# Altium schematic sheet electro1.SchDoc
size A4
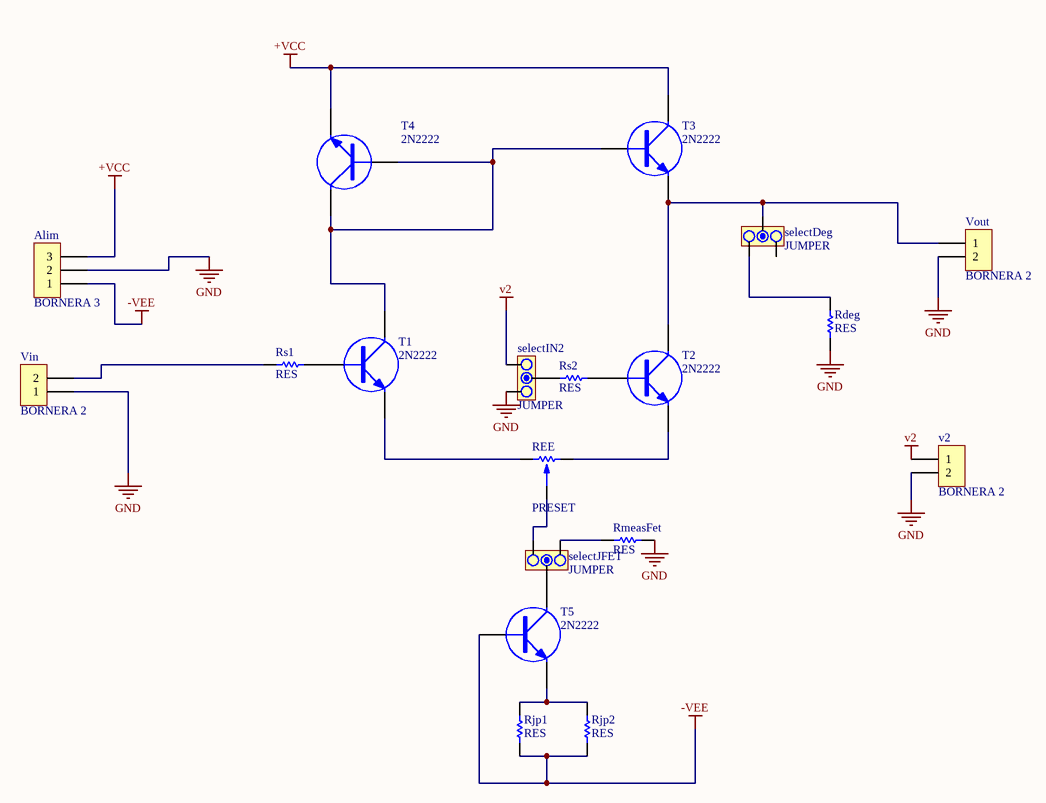
[diagram p0: electro1.SchDoc]

## Parts
Alim  BORNERA 3  [BORNERA3]
Rdeg  RES  [RES300]
REE  PRESET  [PRESET V]
Rjp1  RES  [RES300]
Rjp2  RES  [RES300]
RmeasFet  RES  [RES300]
Rs1  RES  [RES300]
Rs2  RES  [RES300]
selectDeg  JUMPER  [JUMPER3]
selectIN2  JUMPER  [JUMPER3]
selectJFET  JUMPER  [JUMPER3]
T1  2N2222  [TO92]
T2  2N2222  [TO92]
T3  2N2222  [TO92]
T4  2N2222  [TO92]
T5  2N2222  [TO92]
v2  BORNERA 2  [BORNERA2]
Vin  BORNERA 2  [BORNERA2]
Vout  BORNERA 2  [BORNERA2]

## Nets
+VCC: Alim.3 T3.3(C) T4.2(E)
-VEE: Alim.1 Rjp1.1 Rjp2.1 T5.1(B)
GND: Alim.2 Rdeg.1 RmeasFet.2 selectIN2.1 v2.2 Vin.1 Vout.2
v2: selectIN2.3 v2.1
NetRdeg_2: Rdeg.2 selectDeg.3
NetREE_1: REE.1 T2.2(E)
NetREE_2: REE.2 selectJFET.1
NetREE_3: REE.3 T1.2(E)
NetRjp1_2: Rjp1.2 Rjp2.2 T5.2(E)
NetRmeasFet_1: RmeasFet.1 selectJFET.3
NetRs1_1: Rs1.1 Vin.2
NetRs1_2: Rs1.2 T1.1(B)
NetRs2_1: Rs2.1 selectIN2.2
NetRs2_2: Rs2.2 T2.1(B)
NetselectDeg_2: selectDeg.2 T2.3(C) T3.2(E) Vout.1
NetselectJFET_2: selectJFET.2 T5.3(C)
NetT1_3: T1.3(C) T3.1(B) T4.1(B) T4.3(C)

Not connected (* = marked no-connect by the designer): selectDeg 1

## Library data of the parts
selectDeg selectIN2 selectJFET = JUMPER3